# EAGLE design tracker (EAGLE 7.4.0)
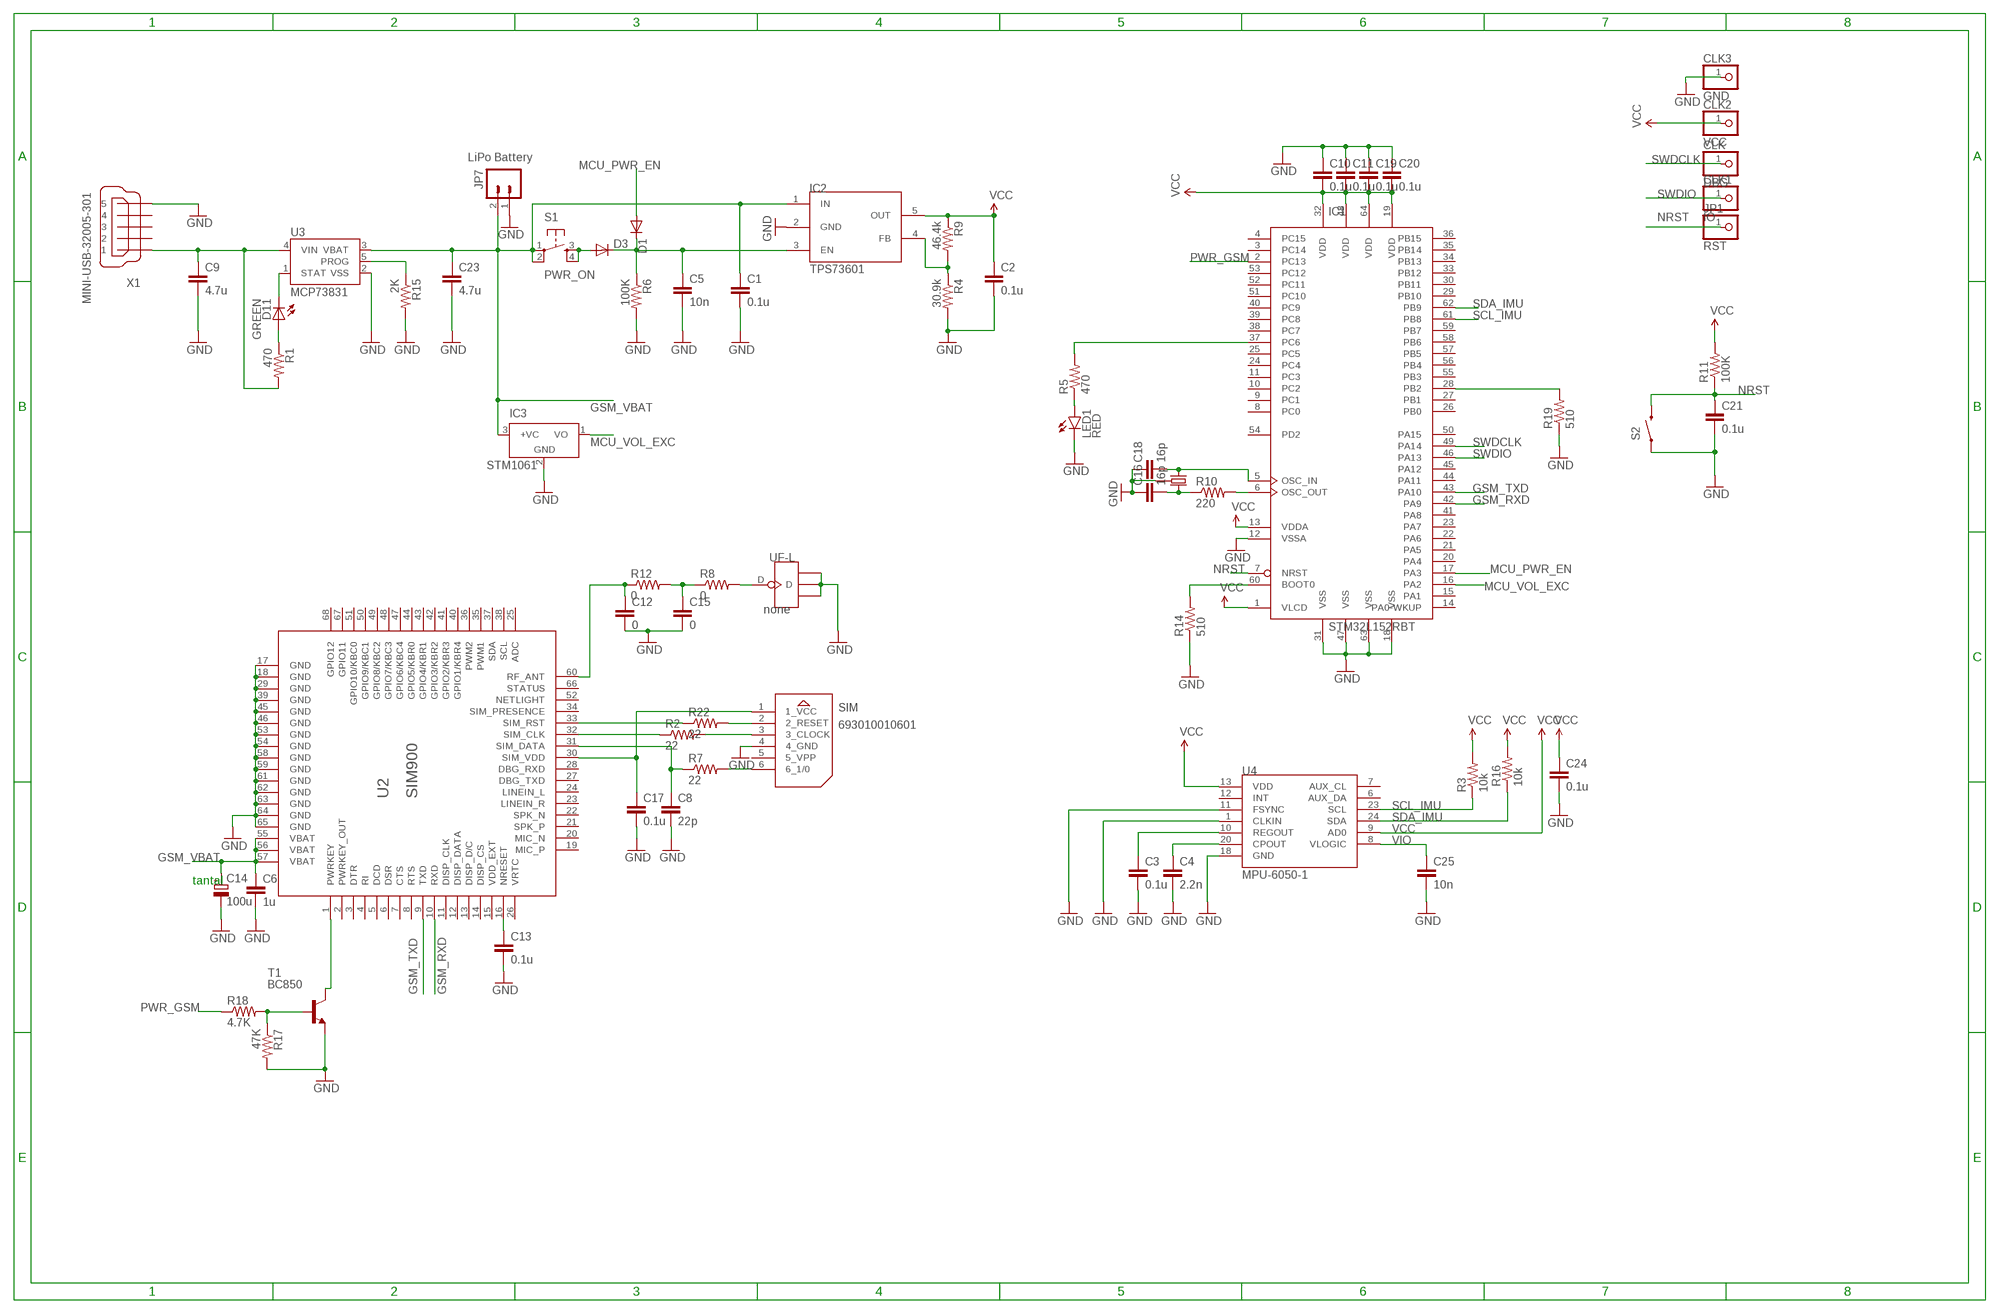
[diagram p0: schematic, sheet 1]

## Parts
C1  0.1u  CAP0805  [0805]
C2  0.1u  CAP0805  [0805]
C3  0.1u  CAP0805  [0805]
C4  2.2n  CAP0805  [0805]
C5  10n  CAP0805  [0805]
C6  1u  CAP0805  [0805]
C8  22p  CAP0805  [0805]
C9  4.7u  CAP0805  [0805]
C10  0.1u  CAP0805  [0805]
C11  0.1u  CAP0805  [0805]
C12  0  CAP0805  [0805]
C13  0.1u  CAP0805  [0805]
C14  100u  CPOL-EUC/6032-28R  [C/6032-28R]
C15  0  CAP0805  [0805]
C16  16p  CAP0603-CAP  [0603-CAP]
C17  0.1u  CAP0805  [0805]
C18  16p  CAP0603-CAP  [0603-CAP]
C19  0.1u  CAP0805  [0805]
C20  0.1u  CAP0805  [0805]
C21  0.1u  CAP0805  [0805]
C23  4.7u  CAP0805  [0805]
C24  0.1u  CAP0805  [0805]
C25  10n  CAP0805  [0805]
CLK  DBG  PINHD-1X1  [1X01]
CLK1  IO  PINHD-1X1  [1X01]
CLK2  VCC  PINHD-1X1  [1X01]
CLK3  GND  PINHD-1X1  [1X01]
D1  MBR0520LT  [SOD123]
D3  MBR0520LT  [SOD123]
D11  GREEN  LED0603  [LED-0603]
IC1  STM32L152RBT  [LQFP64]
IC2  TPS73601  [SOT23]
IC3  LM50  [SOT23]
JP1  RST  PINHD-1X1  [1X01]
JP7  LiPo Battery  M02-JST-2MM-SMT  [JST-2-SMD]
LED1  RED  LED-RED0603  [LED-0603]
R1  470  RESISTOR0805-RES  [0805]
R2  22  RESISTOR0805-RES  [0805]
R3  10k  RESISTOR0805-RES  [0805]
R4  30.9k  RESISTOR0805-RES  [0805]
R5  470  RESISTOR0805-RES  [0805]
R6  100K  RESISTOR0805-RES  [0805]
R7  22  RESISTOR0805-RES  [0805]
R8  0  RESISTOR0805-RES  [0805]
R9  46.4k  RESISTOR0805-RES  [0805]
R10  220  RESISTOR0805-RES  [0805]
R11  100K  RESISTOR0805-RES  [0805]
R12  0  RESISTOR0805-RES  [0805]
R14  510  RESISTOR0805-RES  [0805]
R15  2K  RESISTOR0805-RES  [0805]
R16  10k  RESISTOR0805-RES  [0805]
R17  47K  RESISTOR0805-RES  [0805]
R18  4.7K  RESISTOR0805-RES  [0805]
R19  510  RESISTOR0805-RES  [0805]
R22  22  RESISTOR0805-RES  [0805]
S1  PWR_ON  TAC_SWITCHPTH  [TACTILE-PTH]
S2  SWITCH-MOMENTARY-2SMD-REDUNDANT  [TACTILE-SWITCH-SMD]
SIM  693010010601  [693010010601]
T1  BC850  [SOT23]
U2  SIM900  [SIM900]
U3  MCP73831  [SOT23-5]
U4  MPU-6050-1  [QFN-24-4MM2]
U$1  CRYSTAL-GROUNDED  [CRYSTAL-SMD-5X3]
UF-L  none  ANTENNA-U-FL  [4P-U-FL]
X1  MINI-USB-32005-301  [32005-301]

## Nets
BOOT1: IC1.28(PB2) R19.2
GND: C1.2 C2.2 C3.2 C4.2 C5.2 C6.2 C8.2 C9.2 C10.1 C11.1 C12.2 C13.2 C14.- C15.2 C16.1 C17.2 C18.1 C19.1 C20.1 C21.2 C23.2 C24.2 C25.2 CLK3.1 IC1.12(VSSA) IC1.18(VSS) IC1.31(VSS) IC1.47(VSS) IC1.63(VSS) IC2.2(GND) IC3.2(GND) JP7.1 LED1.C R4.2 R6.2 R14.1 R15.2 R17.2 R19.1 S2.1 S2.2 SIM.4(4_GND) T1.2(E) U2.17(GND) U2.18(GND) U2.29(GND) U2.39(GND) U2.45(GND) U2.46(GND) U2.53(GND) U2.54(GND) U2.58(GND) U2.59(GND) U2.61(GND) U2.62(GND) U2.63(GND) U2.64(GND) U2.65(GND) U3.2(VSS) U4.1(CLKIN) U4.11(FSYNC) U4.18(GND) U$1.2 U$1.4 UF-L.GND1 UF-L.GND2 UF-L.GND3 X1.5
GSM_RXD: IC1.42(PA9) U2.10(RXD)
GSM_TXD: IC1.43(PA10) U2.9(TXD)
GSM_VBAT: C1.1 C6.1 C14.+ C23.1 IC2.1(IN) IC3.3(+VC) JP7.2 S1.1 S1.2 U2.55(VBAT) U2.56(VBAT) U2.57(VBAT) U3.3(VBAT)
MCU_PWR_EN: D1.A IC1.17(PA3)
MCU_VOL_EXC: IC1.16(PA2) IC3.1(VO)
N$1: C12.1 R12.1 U2.60(RF_ANT)
N$2: R7.2 SIM.6(6_1/0)
N$3: C13.1 U2.16(NRESET)
N$4: C15.1 R8.1 R12.2
N$5: R2.2 SIM.3(3_CLOCK)
N$6: R22.2 SIM.2(2_RESET)
N$7: IC1.37(PC6) R5.2
N$8: C18.2 IC1.5(OSC_IN) U$1.3
N$9: C16.2 R10.1 U$1.1
N$11: R17.1 R18.2 T1.1(B)
N$12: D11.A R1.1
N$13: IC2.4(FB) R4.1 R9.2
N$15: IC1.6(OSC_OUT) R10.2
N$16: IC1.60(BOOT0) R14.2
N$17: D3.A S1.3 S1.4
N$18: T1.3(C) U2.1(PWRKEY)
N$27: LED1.A R5.1
N$28: R8.2 UF-L.D
N$29: C4.1 U4.20(CPOUT)
N$30: C3.1 U4.10(REGOUT)
NRST: C21.1 IC1.7(NRST) JP1.1 R11.1 S2.3 S2.4
PROG: R15.1 U3.5(PROG)
PWR_GSM: IC1.2(PC13) R18.1
SCL_IMU: IC1.61(PB8) R3.1 U4.23(SCL)
SDA_IMU: IC1.62(PB9) R16.1 U4.24(SDA)
SIM_CLK: R2.1 U2.32(SIM_CLK)
SIM_DATA: C8.1 R7.1 U2.31(SIM_DATA)
SIM_RST: R22.1 U2.33(SIM_RST)
SIM_VDD: C17.1 SIM.1(1_VCC) U2.30(SIM_VDD)
STAT: D11.C U3.1(STAT)
SWDCLK: CLK.1 IC1.49(PA14)
SWDIO: CLK1.1 IC1.46(PA13)
VCC: C2.1 C10.2 C11.2 C19.2 C20.2 C24.1 CLK2.1 IC1.1(VLCD) IC1.13(VDDA) IC1.19(VDD) IC1.32(VDD) IC1.48(VDD) IC1.64(VDD) IC2.5(OUT) R3.2 R9.1 R11.2 R16.2 U4.9(AD0) U4.13(VDD)
VCC_GSM: C5.1 D1.C D3.C IC2.3(EN) R6.1
VIN1: C9.1 R1.2 U3.4(VIN) X1.1
VIO: C25.1 U4.8(VLOGIC)
Unconnected: IC1.3(PC14) IC1.4(PC15) IC1.8(PC0) IC1.9(PC1) IC1.10(PC2) IC1.11(PC3) IC1.14(PA0-WKUP) IC1.15(PA1) IC1.20(PA4) IC1.21(PA5) IC1.22(PA6) IC1.23(PA7) IC1.24(PC4) IC1.25(PC5) IC1.26(PB0) IC1.27(PB1) IC1.29(PB10) IC1.30(PB11) IC1.33(PB12) IC1.34(PB13) IC1.35(PB14) IC1.36(PB15) IC1.38(PC7) IC1.39(PC8) IC1.40(PC9) IC1.41(PA8) IC1.44(PA11) IC1.45(PA12) IC1.50(PA15) IC1.51(PC10) IC1.52(PC11) IC1.53(PC12) IC1.54(PD2) IC1.55(PB3) IC1.56(PB4) IC1.57(PB5) IC1.58(PB6) IC1.59(PB7) SIM.5(5_VPP) U2.2(PWRKEY_OUT) U2.3(DTR) U2.4(RI) U2.5(DCD) U2.6(DSR) U2.7(CTS) U2.8(RTS) U2.11(DISP_CLK) U2.12(DISP_DATA) U2.13(DISP_D/C) U2.14(DISP_CS) U2.15(VDD_EXT) U2.19(MIC_P) U2.20(MIC_N) U2.21(SPK_P) U2.22(SPK_N) U2.23(LINEIN_R) U2.24(LINEIN_L) U2.25(ADC) U2.26(VRTC) U2.27(DBG_TXD) U2.28(DBG_RXD) U2.34(SIM_PRESENCE) U2.35(PWM1) U2.36(PWM2) U2.37(SDA) U2.38(SCL) U2.40(GPIO1/KBR4) U2.41(GPIO2/KBR3) U2.42(GPIO3/KBR2) U2.43(GPIO4/KBR1) U2.44(GPIO5/KBR0) U2.47(GPIO6/KBC4) U2.48(GPIO7/KBC3) U2.49(GPIO8/KBC2) U2.50(GPIO9/KBC1) U2.51(GPIO10/KBC0) U2.52(NETLIGHT) U2.66(STATUS) U2.67(GPIO11) U2.68(GPIO12) U4.6(AUX_DA) U4.7(AUX_CL) U4.12(INT) X1.2 X1.3 X1.4

## Notes on the sheet
- STM1061
- tantal

## Library data of the parts
C1-C6 C8-C13 C15-C21 C23-C25 = SparkFun:CAP: Capacitor Standard 0603 ceramic capacitor, and 0.1" leaded capacitor.
C14 = rcl:CPOL-EU: POLARIZED CAPACITOR, European symbol
CLK CLK1-CLK3 JP1 = pinhead:PINHD-1X1: PIN HEADER
D1 D3 = diode:MBR0520LT: SCHOTTKY BARRIER RECTIFIER Source: http://onsemi.com .. MBR0520LT1-D.pdf
D11 = SparkFun:LED: LEDs Standard schematic elements and footprints for 5mm, 3mm, 1206, and 0603 sized LEDs. 5mm - Spark Fun Electronics SKU : COM-00529 (and others)
IC1 = micro-stm_v2:STM32L152R*T: ARM 32-bit Cortex™-M3 CPU 32 MHz maximum frequency 32 to 384 Kbytes of Flash memory 4 to 12 kbytes of SRAM 51 GPIOs 1.8 to 3.6 V application supply
IC2 = tps73xx:TPS73601
IC3 = linear_LM50:LM50: SOT-23 Single-Supply Centigrade Temperature Sensor Vout = (10mV/°C x Temp °C) +5mmmV Source: http://cache.national.com/ds/LM/LM50.pdf
JP7 = SparkFun:M02: Header 2 Standard 2-pin 0.1" header. Use with straight break away headers (SKU : PRT-00116), right angle break away headers (PRT-00553), swiss pins (PRT-00743), machine pins (PRT-00117), and female headers (PRT-00115). Molex polarized connector foot print use with SKU : PRT-08233 with associated crimp pins and housings.
LED1 = SparkFun-LED:LED-RED: Assorted Red LEDs LilyPad 1206- DIO-09912 1206- DIO-00809 0603- DIO-00819; PROD_ID: DIO-00819
R1-R12 R14-R19 R22 = SparkFun:RESISTOR: Resistor Basic schematic elements and footprints for 0603, 1206, and PTH resistors.
S1 = SparkFun-Electromechanical:TAC_SWITCH: Momentary Switch Button commonly used for reset or general input. Spark Fun Electronics SKU : COM-00097 SMT- SWCH-08247
S2 = SparkFun-Electromechanical:SWITCH-MOMENTARY-2: Various NO switches- pushbuttons, reed, etc
SIM = Speicherkarten-SockelWR-CRD:693010010601: WR-CRDSIM CARD CONNECTOR HEADER 6PINS=>Code : Con_I-O_COM_CRD_SIM_Mini_693010010601 <http://katalog.we-online.de/media/images/eican/Con_I-O_COM_CRD_SIM_Mini_693010010601_pf2.jpg> Details see: http://katalog.we-online.de/en/em/693_010_010_601 Created 2014-07-09, Karrer Zheng 2014 (C) Würth Elektronik
T1 = transistor:BC850: NPN TRANSISTOR
U2 = ICs_v54:SIM900
U3 = SparkFun:MCP73831: Microchip's MCP73831 Miniature single cell, fully integrated Li-Ion, Li-polymer charge management controller http://ww1.microchip.com/downloads/en/DeviceDoc/21984a.pdf
U4 = Testing:MPU-6050
U$1 = SparkFun-FreqCtrl:CRYSTAL-GROUNDED
UF-L = Connector:ANTENNA-U-FL
X1 = con-cypressindustries:MINI-USB-: MINI USB-B Conector Source: www.cypressindustries.com; OC_FARNELL: unknown; OC_NEWARK: unknown

## Net classes
0 default: clearance 0.152 mm

## Board
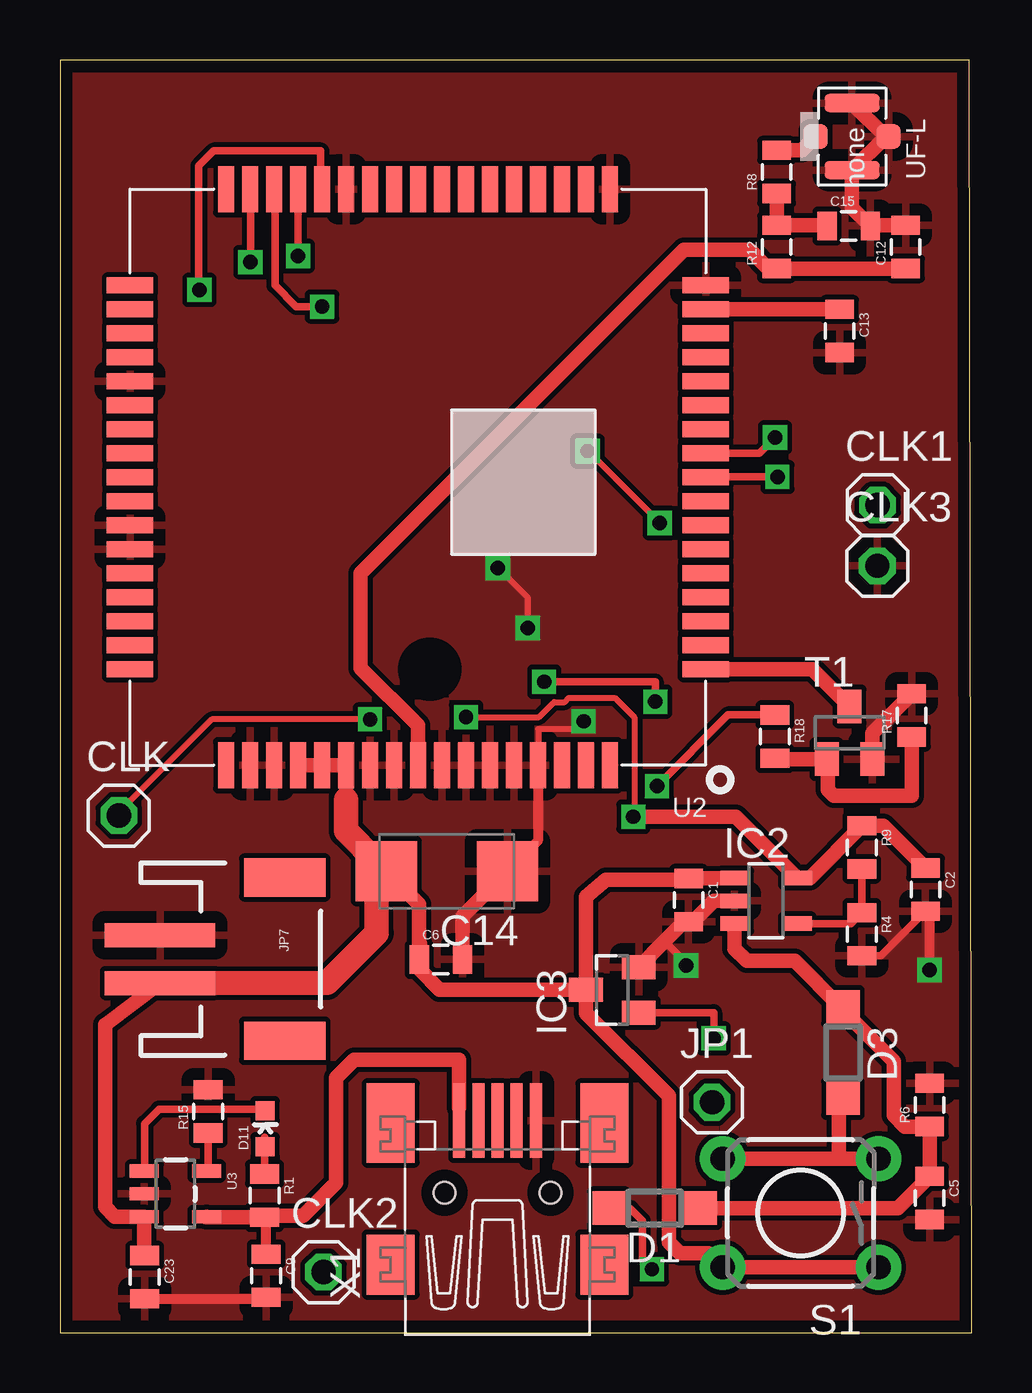
[diagram p1: board, top side]
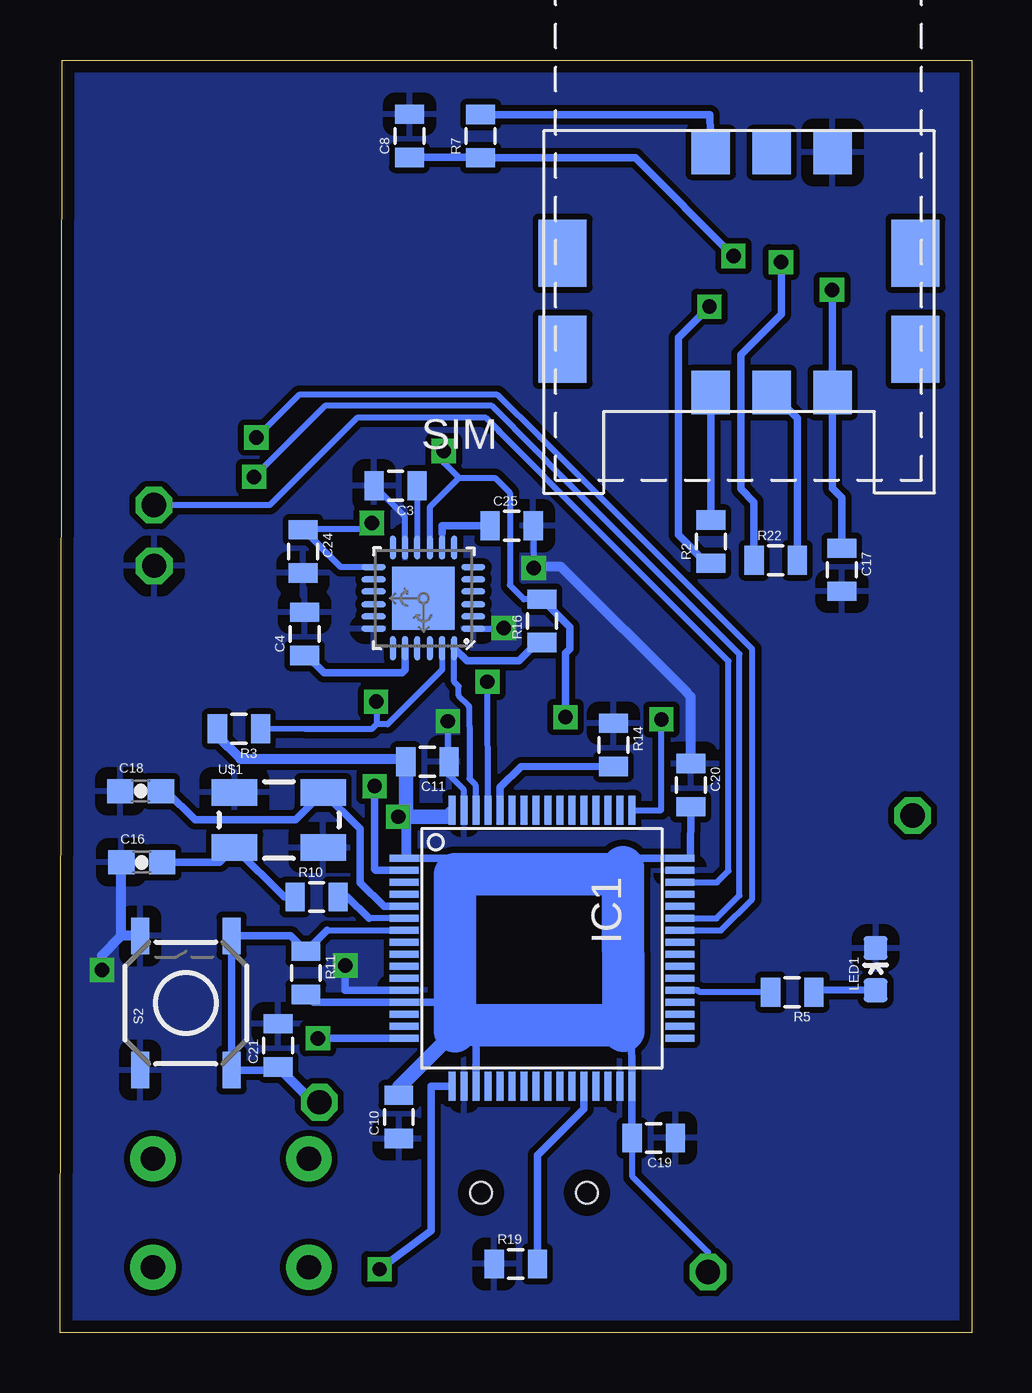
[diagram p2: board, bottom side, seen from below]

Size 38 x 53.04 mm. Coordinates in mm from the lower left corner, seen from the top.
Outline: 0,0 38,0 37.9,53.04 0,53.04 0,0
Copper layers (1*16): Top 0.035mm / dielectric 1.5mm / Bottom 0.035mm
Design rules "default *": minimum track width 10mil, minimum drill 20mil, track to track 8mil, track to pad 8mil, pad to pad 8mil, via to via 8mil, smd to smd 8mil, copper to edge 20mil, drill to drill 10mil, minimum pad ring 10mil, minimum via ring 8mil, stop-mask expansion 4mil, vias tented up to drill 0mil, thermal gap 20mil

### Footprints (pad centres in the part's own frame; a part is rotated, then mirrored left to right if it is on the bottom)
0805 = smd 0.8 x 1.2: 1 -0.9,0; 2 0.9,0
C/6032-28R = smd 2.55 x 2.5: + 2.525,0; - -2.525,0
0603-CAP = smd 1.1 x 1: 1 -0.85,0; 2 0.85,0
1X01 = drill 1.016 octagon: 1 0,0
SOD123 = smd 1.4 x 1.4: A 1.9,0; C -1.9,0
LED-0603 = smd 0.8 x 0.8: A 0,-0.75; C 0,0.75
LQFP64 = smd 0.3 x 1.2: 1 -3.75,-5.75; 2 -3.25,-5.75; 3 -2.75,-5.75; 4 -2.25,-5.75; 5 -1.75,-5.75; 6 -1.25,-5.75; 7 -0.75,-5.75; 8 -0.25,-5.75; 9 0.25,-5.75; 10 0.75,-5.75; 11 1.25,-5.75; 12 1.75,-5.75; 13 2.25,-5.75; 14 2.75,-5.75; 15 3.25,-5.75; 16 3.75,-5.75; 33 3.75,5.75; 34 3.25,5.75; 35 2.75,5.75; 36 2.25,5.75; 37 1.75,5.75; 38 1.25,5.75; 39 0.75,5.75; 40 0.25,5.75; 41 -0.25,5.75; 42 -0.75,5.75; 43 -1.25,5.75; 44 -1.75,5.75; 45 -2.25,5.75; 46 -2.75,5.75; 47 -3.25,5.75; 48 -3.75,5.75 | smd 1.2 x 0.3: 17 5.75,-3.75; 18 5.75,-3.25; 19 5.75,-2.75; 20 5.75,-2.25; 21 5.75,-1.75; 22 5.75,-1.25; 23 5.75,-0.75; 24 5.75,-0.25; 25 5.75,0.25; 26 5.75,0.75; 27 5.75,1.25; 28 5.75,1.75; 29 5.75,2.25; 30 5.75,2.75; 31 5.75,3.25; 32 5.75,3.75; 49 -5.75,3.75; 50 -5.75,3.25; 51 -5.75,2.75; 52 -5.75,2.25; 53 -5.75,1.75; 54 -5.75,1.25; 55 -5.75,0.75; 56 -5.75,0.25; 57 -5.75,-0.25; 58 -5.75,-0.75; 59 -5.75,-1.25; 60 -5.75,-1.75; 61 -5.75,-2.25; 62 -5.75,-2.75; 63 -5.75,-3.25; 64 -5.75,-3.75
SOT23 = smd 0.6 x 1.2: 1 -0.95,-1.306; 2 0,-1.306; 3 0.95,-1.306; 4 0.95,1.306; 5 -0.95,1.306
SOT23' = smd 1 x 1.4: 1 -0.95,-1.1; 2 0.95,-1.1; 3 0,1.1
JST-2-SMD = smd 1 x 4.6: 1 -1,-3.7; 2 1,-3.7 | smd 1.6 x 3.4: NC1 -3.4,1.5; NC2 3.4,1.5
LED-0603' = smd 1 x 1: A 0,-0.877; C 0,0.877
TACTILE-PTH = drill 1.016 pad 1.88: 1 -3.251,2.261; 2 3.251,2.261; 3 -3.251,-2.261; 4 3.251,-2.261
TACTILE-SWITCH-SMD = smd 1.524 x 0.762: 1 -2.794,1.905; 2 2.794,1.905; 3 -2.794,-1.905; 4 2.794,-1.905
693010010601 = smd 1.6 x 1.8: 1 0,11.6; 2 2.54,11.6; 3 5.08,11.6; 4 0,1.6; 5 2.54,1.6; 6 5.08,1.6 | smd 2 x 2.8: Z1 -3.45,9.8; Z2 -3.45,5.8; Z3 11.25,9.8; Z4 11.25,5.8
SIM900 = smd 1.93 x 0.66: 1 -12,8; 2 -12,7; 3 -12,6; 4 -12,5; 5 -12,4; 6 -12,3; 7 -12,2; 8 -12,1; 9 -12,0; 10 -12,-1; 11 -12,-2; 12 -12,-3; 13 -12,-4; 14 -12,-5; 15 -12,-6; 16 -12,-7; 17 -12,-8; 35 12,-8; 36 12,-7; 37 12,-6; 38 12,-5; 39 12,-4; 40 12,-3; 41 12,-2; 42 12,-1; 43 12,0; 44 12,1; 45 12,2; 46 12,3; 47 12,4; 48 12,5; 49 12,6; 50 12,7; 51 12,8 | smd 0.66 x 1.93: 18 -8,-12; 19 -7,-12; 20 -6,-12; 21 -5,-12; 22 -4,-12; 23 -3,-12; 24 -2,-12; 25 -1,-12; 26 0,-12; 27 1,-12; 28 2,-12; 29 3,-12; 30 4,-12; 31 5,-12; 32 6,-12; 33 7,-12; 34 8,-12; 52 8,12; 53 7,12; 54 6,12; 55 5,12; 56 4,12; 57 3,12; 58 2,12; 59 1,12; 60 0,12; 61 -1,12; 62 -2,12; 63 -3,12; 64 -4,12; 65 -5,12; 66 -6,12; 67 -7,12; 68 -8,12
SOT23-5 = smd 0.55 x 1.2: 1 -0.95,-1.3; 2 0,-1.3; 3 0.95,-1.3; 4 0.95,1.3; 5 -0.95,1.3
QFN-24-4MM2 = smd 1.016 x 0.254: 1 -2.066,1.257; 2 -2.066,0.75; 3 -2.066,0.247; 4 -2.066,-0.287; 5 -2.066,-0.792; 6 -2.066,-1.297; 13 2.086,-1.297; 14 2.086,-0.792; 15 2.086,-0.287; 16 2.086,0.247; 17 2.086,0.75; 18 2.086,1.257 | smd 0.254 x 1.016: 7 -1.267,-2.122; 8 -0.762,-2.122; 9 -0.258,-2.122; 10 0.278,-2.122; 11 0.78,-2.122; 12 1.287,-2.122; 19 1.287,2.082; 20 0.78,2.082; 21 0.278,2.082; 22 -0.258,2.082; 23 -0.762,2.082; 24 -1.267,2.082 | smd 2.616 x 2.616: P$1 0.02,-0.01
CRYSTAL-SMD-5X3 = smd 1.9 x 1.1: 1 -1.85,-1.15; 2 1.85,-1.15; 3 1.85,1.15; 4 -1.85,1.15
4P-U-FL = smd 1.016 x 1.016: D -1.524,0; GND3 1.524,0 | smd 2.286 x 0.762: GND1 0,1.397; GND2 0,-1.397
32005-301 = smd 3.1 x 0.5: 1 3,1.6; 2 3,0.8; 3 3,0; 4 3,-0.8; 5 3,-1.6 | smd 2.5 x 2: M1 -3,-4.45; M2 -3,4.45 | smd 3.3 x 2: M3 2.9,4.45; M4 2.9,-4.45 | hole 0.9: 0,2.2; 0,-2.2

### Placement (x,y rotation side)
C1  26.2,18.04 270 top
C2  36.08,18.48 270 top
C3  24.01,35.3 180 bottom
C4  27.8,29.13 90 bottom
C5  36.25,5.62 270 top
C6  15.88,15.56 0 top
C8  23.43,49.88 90 bottom
C9  8.6,2.38 270 top
C10  23.88,9 90 bottom
C11  22.68,23.8 180 bottom
C12  35.25,45.25 90 top
C13  32.5,41.75 270 top
C14  16.13,19.24 180 top
C15  32.88,46.12 0 top
C16  34.59,19.61 0 bottom
C17  5.41,31.8 270 bottom
C18  34.64,22.57 0 bottom
C19  13.25,8.12 180 bottom
C20  11.7,22.82 270 bottom
C21  28.91,11.98 90 bottom
C23  3.53,2.33 270 top
C24  27.86,32.57 270 bottom
C25  19.18,33.63 0 bottom
CLK  2.46,21.56 0 top
CLK1  34.08,34.49 0 top
CLK2  10.99,2.54 0 top
CLK3  34.07,31.96 0 top
D1  24.79,5.2 180 top
D3  32.64,11.69 270 top
D11  8.55,8.51 0 top
IC1  17.91,16.02 270 bottom
IC2  29.43,18 270 top
IC3  LM50  [SOT23']  23.02,14.29 90 top
JP1  27.18,9.61 0 top
JP7  7.87,15.58 270 top
LED1  RED  [LED-0603']  4,15.16 0 bottom
R1  8.53,5.72 270 top
R2  10.86,32.98 90 bottom
R3  30.54,25.18 180 bottom
R4  33.43,16.61 270 top
R5  7.47,14.2 180 bottom
R6  36.25,9.5 90 top
R7  20.46,49.87 90 bottom
R8  29.88,48.38 90 top
R9  33.43,20.23 270 top
R10  27.3,18.17 0 bottom
R11  27.75,15 270 bottom
R12  29.88,45.25 90 top
R14  14.92,24.5 270 bottom
R15  6.17,9.23 90 top
R16  17.91,29.67 90 bottom
R17  35.5,25.73 90 top
R18  29.8,24.85 270 top
R19  19,2.88 0 bottom
R22  8.16,32.2 0 bottom
S1  30.88,5 180 top
S2  32.75,13.75 90 bottom
SIM  5.79,50.79 180 bottom
T1  BC850  [SOT23']  32.91,25.01 0 top
U2  14.92,35.66 180 top
U3  4.82,5.79 270 top
U4  22.84,30.61 180 bottom
U$1  28.88,21.38 0 bottom
UF-L  33.02,49.85 0 top
X1  18.24,5.85 90 top

### Tracks (layer width: path | path; a pad name or v marks a point on that pad's centre or on a via)
BOOT1
  Bottom 0.305: R19.2 18.1,7.4 16.15,9.35 16.16,9.35 IC1.28
GND  (via drill 0.6)
  Top 0.254: v19.5,29.38 19.5,30.62 v18.25,31.88 | U2.65 19.95,23.66 19.95,25.16 21.5,25.16 v21.83,25.49
  Top 0.305: R4.2 34.22,15.71 C2.2 | v26.11,15.31 26.11,15.41 25.2,16.32 | IC2.2
  Top 0.406: C23.2 8.6,1.43 C9.2 | 19.52,29.35 v19.5,29.38 | U2.65 19.92,20.5 C14.- | v36.25,15.12 36.25,17.41 C2.2
  Top 0.61: C6.2 16.77,17.36 C14.- | 26.39,17.14 27.25,18 IC2.2 | C1.2 26.02,17.14 25.2,16.32 IC3.2 | 34.42,49.85 UF-L.GND1 | UF-L.GND3 34.42,49.85 | 34.42,49.85 UF-L.GND2 33.02,46.88 C15.2 33.8,46.15 C12.2 | T1.2 33.87,24.99 R17.2
  Bottom 0.254: IC1.63 21.16,22.63 21.75,23.22 | 21.75,23.22 21.79,23.26 | 21.79,23.26 C11.1 | U4.11 23.61,34 C3.2 | U4.1 19.5,29.35 v19.5,29.38 | v18.25,31.88 18.25,33.96 C25.2 | 21.75,23.22 21.75,23.62 | 21.79,23.26 21.84,23.32 v21.83,25.49 | 11.7,26.52 11.83,26.64
  Bottom 0.305: U$1.4 31,22.8 | IC1.12 26.11,14.28 v26.11,15.31 | 21.75,23.62 21.88,23.62
  Bottom 0.406: 35.44,16.54 C16.1 | S2.2 35.44,16.54 | v36.25,15.12 36.25,15.73 35.44,16.54 | 11.83,26.64 17.11,31.92 18.2,31.92 v18.25,31.88 | C20.1 11.7,26.52
  pour Top: 0.25,52.88 38.12,52.88 38.12,-0.12 0.25,-0.12
  pour Bottom (isolate 0.254): -0.12,0 37.88,0 37.88,52.88 -0.12,52.88
GSM_RXD  (via drill 0.6)
  Top 0.305: v29.81,37.31 29.15,36.66 U2.10
  Bottom 0.254: IC1.42 10.44,16.77 9.14,18.08 9.14,28.48 17.98,37.31 19.75,39.09 28.04,39.09 v29.81,37.31
GSM_TXD  (via drill 0.6)
  Top 0.305: v29.91,35.67 26.93,35.67 U2.9
  Bottom 0.254: IC1.43 10.63,17.27 9.67,18.24 9.67,28.28 17.72,36.33 18.18,36.8 18.18,36.81 20,38.62 26.95,38.62 v29.91,35.67
  Bottom 0.305: v29.9,35.68 v29.91,35.67
GSM_VBAT
  Top 0.61: C23.1 3.52,3.24 U3.3 2.28,4.84 1.88,5.25 1.88,12.85 JP7.2 | C14.+ 14.97,17.87 C6.1 15,16.23 15,15.12 15.83,14.29 IC3.3 | IC3.3 21.93,13.32 25.38,9.88 25.38,3.79 25.84,3.32 27.04,3.32 S1.2 S1.1 | IC3.3 21.93,18.18 22.75,18.88 26.14,18.88 C1.1 26.22,18.95 IC2.1 | U2.57 U2.56 U2.55 | U2.57 | 11.92,22.22 U2.57
  Top 1.016: JP7.2 11.13,14.59 13.21,16.66 13.21,19.64 | C14.+ 13.21,19.64 | 13.21,19.64 11.92,20.93 11.92,22.22
MCU_PWR_EN  (via drill 0.6)
  Top 0.305: D1.A 22.91,5.18 23.78,5.18 24.28,4.68 24.28,3.05 v24.68,2.65
  Bottom 0.305: 21.67,10.26 IC1.17 22.53,10.28 22.53,4.26 v24.68,2.65
MCU_VOL_EXC  (via drill 0.6)
  Top 0.305: IC3.1 27.25,13.35 v27.25,12.28
  Bottom 0.305: IC1.16 v27.25,12.28
N$1
  Top 0.61: U2.60 14.92,25.32 12.53,27.7 12.53,31.66 26,45.12 28.75,45.12 29.52,44.35 R12.1 C12.1
N$2
  Bottom 0.305: SIM.6 10.9,50.76 R7.2
N$3
  Top 0.61: U2.16 32.55,42.66 C13.1
N$4
  Top 0.61: C15.1 31.95,46.15 R12.2 R8.1
N$5
  Bottom 0.305: R2.2 10.86,37.68 SIM.3
N$6
  Bottom 0.305: R22.2 7.26,38.12 SIM.2
N$7
  Bottom 0.254: 12.14,14.29 IC1.37 12.15,14.28 11.42,14.28 11.39,14.26 11.39,14.25 11.34,14.2 R5.2
N$8
  Bottom 0.305: C18.2 33.57,22.57 32.38,21.38 28.18,21.38 U$1.3 25.5,21 25.5,18.75 24.5,17.77 IC1.5
N$9
  Bottom 0.305: R10.1 28.67,18.17 U$1.1 31.34,19.61 C16.2
N$11
  Top 0.61: R18.2 29.84,23.91 T1.1 32,23.88 32,22.62 32.25,22.38 35.52,22.37 35.5,22.39 R17.1
N$12
  Top 0.305: R1.1 8.53,8.16 D11.A
N$13
  Top 0.305: R9.2 R4.1 32.97,17.05 IC2.4
N$15
  Bottom 0.254: IC1.6 25.12,17.27
  Bottom 0.305: R10.2 26.04,18.17 25.12,17.27
N$16
  Bottom 0.305: R14.2 18.77,23.6 19.66,22.74 19.66,21.74 IC1.60
N$17
  Top 0.61: S1.3 32.48,7.26 | 32.48,7.26 S1.4 | D3.A 32.48,9.79 32.48,7.26
N$18
  Top 0.61: U2.1 31.37,27.66 T1.3
N$27
  Bottom 0.305: LED1.A 6.54,14.3 R5.1
N$28
  Top 0.61: R8.2 30.92,49.27 UF-L.D
N$29
  Bottom 0.305: C4.1 27.73,28.23 27,27.5 23.75,27.5 23.62,27.62 23.62,28.52 U4.20
N$30
  Bottom 0.254: C3.1 23.11,34.46 U4.10
NRST
  Bottom 0.254: 26.88,16.77 IC1.7
  Bottom 0.305: 26.88,16.77 R11.1 28.39,16.54 S2.4 S2.3 28.57,10.96 C21.1
  Bottom 0.406: JP1.1 27.44,9.61 C21.1
PROG
  Top 0.305: R15.1 6.18,6.67 U3.5
PWR_GSM  (via drill 0.6)
  Top 0.305: R18.1 27.85,25.75 v24.89,22.78
  Bottom 0.305: v24.89,22.78 24.89,19.32 24.84,19.27 IC1.2
SCL_IMU  (via drill 0.6)
  Top 0.254: 24.81,26.44 v24.82,26.31 24.81,26.45
  Top 0.305: v20.18,27.13 24.82,27.13 v24.82,26.31
  Bottom 0.254: R3.1 27.76,25.16 25,25.16 24.81,25.36 | IC1.61 v20.18,27.13 | v24.82,26.31 24.81,25.36 | U4.23 22.07,27.64 24.35,25.36 24.81,25.36
SDA_IMU
  Bottom 0.254: IC1.62 20.68,21.8 20.68,22.84 20.93,23.09 20.93,25.3 20.93,26.08 20.98,26.13 20.98,26.15 21.38,26.55 21.38,26.94 21.57,27.13 U4.24
  Bottom 0.305: 18.11,28.77 18.88,28 21.04,28 U4.24
  Bottom 0.406: R16.1 18.11,28.77
SIM_CLK  (via drill 0.6)
  Top 0.305: v10.93,42.76 9.85,42.76 8.96,43.65 8.96,47.61 U2.32
  Bottom 0.305: v10.93,42.76 12.22,41.47 12.22,33.25 11.05,32.08
  Bottom 0.406: R2.1 11.05,32.08
SIM_DATA  (via drill 0.6)
  Top 0.305: U2.31 v9.92,44.88 v9.92,44.87
  Bottom 0.305: C8.1 20.48,48.98 R7.1 14.02,48.97 v9.92,44.87
SIM_RST  (via drill 0.6)
  Top 0.305: v7.94,44.62 7.94,47.64 U2.33
  Bottom 0.305: v7.94,44.62 v7.93,44.61 7.93,42.44 7.99,42.38 8,42.38 9.62,40.76 9.62,35.17 9.06,34.61 R22.1
SIM_VDD  (via drill 0.6)
  Top 0.305: U2.30 10.87,47.7 10.87,49.26 6.42,49.26 5.79,48.63 5.79,43.49 v5.81,43.46
  Bottom 0.305: v5.81,43.46 5.81,37.71 SIM.1 5.79,35.2 5.4,34.8 C17.1
STAT
  Top 0.305: U3.1 3.52,6.75 3.52,8.72 4.12,9.32 8.55,9.32 D11.C
SWDCLK  (via drill 0.6)
  Top 0.254: v12.93,25.57 6.33,25.57 2.46,21.7 CLK.1
  Bottom 0.254: IC1.49 12.93,21.78 v12.93,25.57
SWDIO
  Bottom 0.254: IC1.46 10.61,18.77 10.13,19.25 10.13,27.99 12.34,30.2 17.81,35.66 17.81,35.67 19.69,37.55 19.69,37.56 20.25,38.12 25.62,38.12 29.26,34.49 CLK1.1
VCC  (via drill 0.6)
  Top 0.254: 23.83,21.51 v23.9,21.51 23.94,21.55 23.94,25.65 23.13,26.46 21.21,26.46 21.04,26.29 20.59,26.29 20.53,26.23 19.97,25.66 v16.93,25.66 | v25,33.75 v22,36.75
  Top 0.305: IC2.5 31.25,18.95 | v16.93,25.66 16.93,25.59 | 23.84,21.57 v23.9,21.51
  Top 0.61: 31.25,18.95 R9.1 34.32,21.14 C2.1 | IC2.5 28.18,21.51 v23.9,21.51
  Bottom 0.254: U4.9 22.58,34.42 21.38,35.62 | CLK2.1 10.99,3.37 14.13,6.51 14.13,8.1 C19.2 | C24.1 26.3,31.91 U4.13 26.28,31.91 27.88,33.5 25.25,33.5 v25,33.75 | 21.38,35.62 19.88,35.62 19.25,35 19.25,31.16 18.66,30.57 R16.2 | v22,36.75 22,36.25 21.38,35.62 | IC1.48 11.7,19.77 C20.2 | 23.58,19.85 IC1.1 | 14.52,12.59 14.52,12.48 14.19,12.15
  Bottom 0.305: IC1.64 21.76,21.77 22.02,21.51 | C19.2 14.16,8.13 IC1.32 14.16,11.41 14.19,12.15 | v16.93,25.66 16.93,28.32 16.75,28.5 16.75,29.41 R16.2 | C10.2 23.64,9.9 | C20.2 11.71,19.79 14.53,19.78 | 27.31,13.78 R11.2 27.43,13.78 IC1.13 21.62,13.78 | IC1.19 20.66,12.78 | IC1.1 21.66,19.77
  Bottom 0.406: R3.2 31.44,24.89 30.47,23.92 23.7,23.92 C11.2 | 23.58,21.52 23.58,19.85 | 21.66,19.77 21.66,19.23 21.54,19.11
  Bottom 0.61: v23.9,21.51 22.2,21.51 22.02,21.51 21.85,21.52 23.58,21.52 C11.2 | 14.19,12.15 14.22,12.15 | 14.53,19.78 14.53,19.41 | 20.66,12.78 20.66,12.82 | 20.66,12.82 21.62,13.78 | 23.64,9.9 23.58,9.9 | 20.66,12.82 21.3,12.82 21.54,12.58 23.88,10.24 C10.2
  Bottom 1.778: 14.52,12.59 14.53,19.11 | 14.53,19.11 14.53,19.41 | 14.53,19.11 21.54,19.11 21.54,12.58 | 20.66,12.82 14.59,12.82 14.59,12.85
VCC_GSM
  Top 0.61: R6.1 C5.1 34.93,5.21 D1.C | 36.48,8.62 R6.1 | IC2.3 28.12,16 28.62,15.5 30.62,15.5 32.54,13.59 D3.C 32.64,13.45 34.76,11.33 34.76,9.06 35.23,8.6 R6.1
VIN1
  Top 0.305: X1.1 16.64,9.38 16.62,9.39
  Top 0.406: C9.1 8.6,4.83 R1.2
  Top 0.61: 6.09,4.83 U3.4 6.13,4.83 R1.2 8.57,4.88 10.12,4.88 11.5,6.25 11.5,10.62 12.25,11.38 16.62,11.38 16.62,9.39
VIO
  Bottom 0.254: 22.07,33.32 U4.8
  Bottom 0.305: C25.1 22.07,33.63 22.07,33.32

### Text on the board
Dimension: Found issues: / 1) GND and VCC poligons overlaps (STM32L) | 2) no debug pins | 3)GSM RX pin needs pull up to VDD_EXT | 4) Increase BLD pads size | 5) add more debug pins | 6) remove battery pad